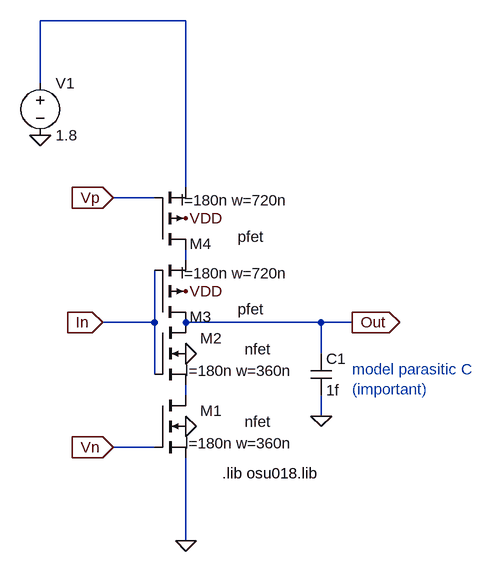
[diagram p0: schematic cs_inv.asc]
cs_inv.asc, the LTspice schematic file:
Version 4
SHEET 1 6288 680
WIRE 656 -752 432 -752
WIRE 432 -656 432 -752
WIRE 656 -496 656 -752
WIRE 608 -480 544 -480
WIRE 656 -384 656 -400
WIRE 608 -288 608 -368
WIRE 608 -288 528 -288
WIRE 864 -288 656 -288
WIRE 912 -288 864 -288
WIRE 864 -240 864 -288
WIRE 608 -208 608 -288
WIRE 656 -176 656 -192
WIRE 864 -144 864 -176
WIRE 608 -96 544 -96
WIRE 656 48 656 -80
FLAG 656 -128 0
FLAG 656 -448 VDD
FLAG 656 -336 VDD
FLAG 656 -240 0
FLAG 528 -288 In
IOPIN 528 -288 In
FLAG 544 -480 Vp
IOPIN 544 -480 In
FLAG 544 -96 Vn
IOPIN 544 -96 In
FLAG 912 -288 Out
IOPIN 912 -288 Out
FLAG 864 -144 0
FLAG 432 -576 0
FLAG 656 48 0
SYMBOL nmos4 608 -176 R0
WINDOW 0 104 24 Right 2
WINDOW 3 179 41 Right 2
WINDOW 123 213 74 Right 2
SYMATTR InstName M1
SYMATTR Value nfet
SYMATTR Value2 l=180n w=360n
SYMBOL pmos4 608 -400 M180
WINDOW 0 88 9 Right 2
WINDOW 3 168 20 Right 2
WINDOW 123 206 76 Right 2
SYMATTR InstName M4
SYMATTR Value pfet
SYMATTR Value2 l=180n w=720n
SYMBOL pmos4 608 -288 M180
WINDOW 0 88 9 Right 2
WINDOW 3 168 20 Right 2
WINDOW 123 206 76 Right 2
SYMATTR InstName M3
SYMATTR Value pfet
SYMATTR Value2 l=180n w=720n
SYMBOL nmos4 608 -288 R0
WINDOW 0 104 24 Right 2
WINDOW 3 179 41 Right 2
WINDOW 123 213 74 Right 2
SYMATTR InstName M2
SYMATTR Value nfet
SYMATTR Value2 l=180n w=360n
SYMBOL cap 848 -240 R0
SYMATTR InstName C1
SYMATTR Value 1f
SYMBOL voltage 432 -672 R0
WINDOW 123 0 0 Left 0
WINDOW 39 0 0 Left 0
SYMATTR InstName V1
SYMATTR Value 1.8
TEXT 712 -56 Left 2 !.lib osu018.lib
TEXT 912 -216 Left 2 ;model parasitic C\n(important)

The netlist it stands for:
* cs_inv.asc
M1 N003 Vn 0 0 nfet l=180n w=360n
M4 N002 Vp N001 VDD pfet l=180n w=720n
M3 Out In N002 VDD pfet l=180n w=720n
M2 Out In N003 0 nfet l=180n w=360n
C1 Out 0 1f
V1 N001 0 1.8
.model NMOS NMOS
.model PMOS PMOS
.lib standard.mos
.lib osu018.lib
* model parasitic C
* (important)
.backanno
.end